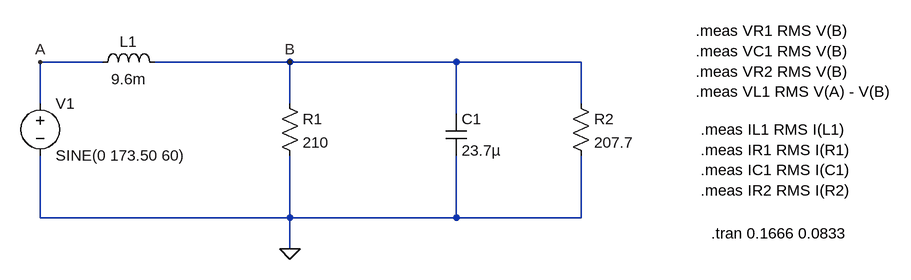
[diagram p0: schematic Lab03.asc]
Lab03.asc, the LTspice schematic file:
Version 4.1
SHEET 1 1492 680
WIRE 96 32 0 32
WIRE 384 32 176 32
WIRE 640 32 384 32
WIRE 832 32 640 32
WIRE 0 96 0 32
WIRE 384 96 384 32
WIRE 832 96 832 32
WIRE 640 112 640 32
WIRE 0 272 0 176
WIRE 384 272 384 176
WIRE 384 272 0 272
WIRE 640 272 640 176
WIRE 640 272 384 272
WIRE 832 272 832 176
WIRE 832 272 640 272
WIRE 384 320 384 272
FLAG 384 320 0
FLAG 0 32 A
FLAG 384 32 B
SYMBOL voltage 0 80 R0
WINDOW 123 0 0 Left 0
WINDOW 39 0 0 Left 0
SYMATTR InstName V1
SYMATTR Value SINE(0 173.50 60)
SYMBOL ind 80 48 R270
WINDOW 0 32 56 VTop 2
WINDOW 3 5 56 VBottom 2
SYMATTR InstName L1
SYMATTR Value 9.6m
SYMBOL res 368 80 R0
SYMATTR InstName R1
SYMATTR Value 210
SYMBOL cap 624 112 R0
SYMATTR InstName C1
SYMATTR Value 23.7µ
SYMBOL res 816 80 R0
SYMATTR InstName R2
SYMATTR Value 207.7
TEXT 1008 -16 Left 2 !.meas VR1 RMS V(B)\n.meas VC1 RMS V(B)\n.meas VR2 RMS V(B)\n.meas VL1 RMS V(A) - V(B)
TEXT 1016 136 Left 2 !.meas IL1 RMS I(L1)\n.meas IR1 RMS I(R1)\n.meas IC1 RMS I(C1)\n.meas IR2 RMS I(R2)
TEXT 1032 296 Left 2 !.tran 0.1666 0.0833

The netlist it stands for:
* Lab03.asc
V1 A 0 SINE(0 173.50 60)
L1 A B 9.6m
R1 B 0 210
C1 B 0 23.7µ
R2 B 0 207.7
.meas VR1 RMS V(B)
.meas VC1 RMS V(B)
.meas VR2 RMS V(B)
.meas VL1 RMS V(A) - V(B)
.meas IL1 RMS I(L1)
.meas IR1 RMS I(R1)
.meas IC1 RMS I(C1)
.meas IR2 RMS I(R2)
.tran 0.1666 0.0833
.backanno
.end

* Results of the author's LTspice run, read from the files saved beside the schematic
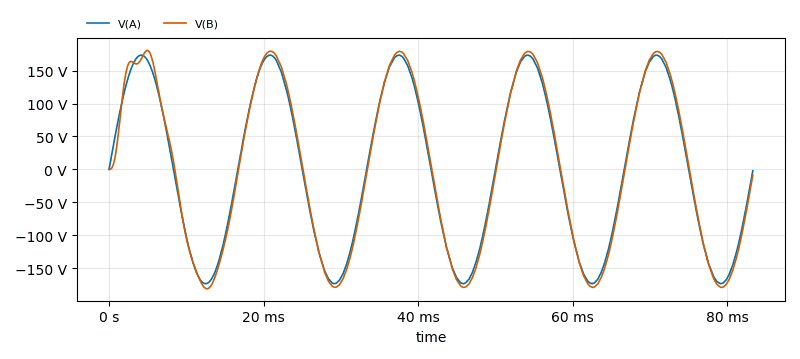
[diagram p1: Transient Analysis of Lab03.asc, plotted from the saved traces]
* Transient Analysis, 1 run:
*   V(A): min -173.5 V, max 173.5 V, average 7.236 mV, rms 122.7 V, last -2.18 V
*   V(B): min -181.3 V, max 180.7 V, average -167 mV, rms 126.8 V, last -8.665 V
* From the log:
*   vr1: RMS(V(B))=126.761338542 FROM 0 TO 0.0833
*   vc1: RMS(V(B))=126.761338542 FROM 0 TO 0.0833
*   vr2: RMS(V(B))=126.761338542 FROM 0 TO 0.0833
*   vl1: RMS(V(A) - V(B))=7.28764402369 FROM 0 TO 0.0833
*   il1: RMS(I(L1))=1.66980266532 FROM 0 TO 0.0833
*   ir1: RMS(I(R1))=0.603625422137 FROM 0 TO 0.0833
*   ic1: RMS(I(C1))=1.14643310649 FROM 0 TO 0.0833
*   ir2: RMS(I(R2))=0.610309768306 FROM 0 TO 0.0833